# Altium schematic sheet Sheet1.SCHDOC
size 420 x 297 mm; SheetNumber: 1; SheetTotal: 1; Scale: 1:1; DocumentType: Схема электрическая принципиальная; FirstReferrence: АБВГ.123456.001; DocumentName: Sheet1.SCHDOC
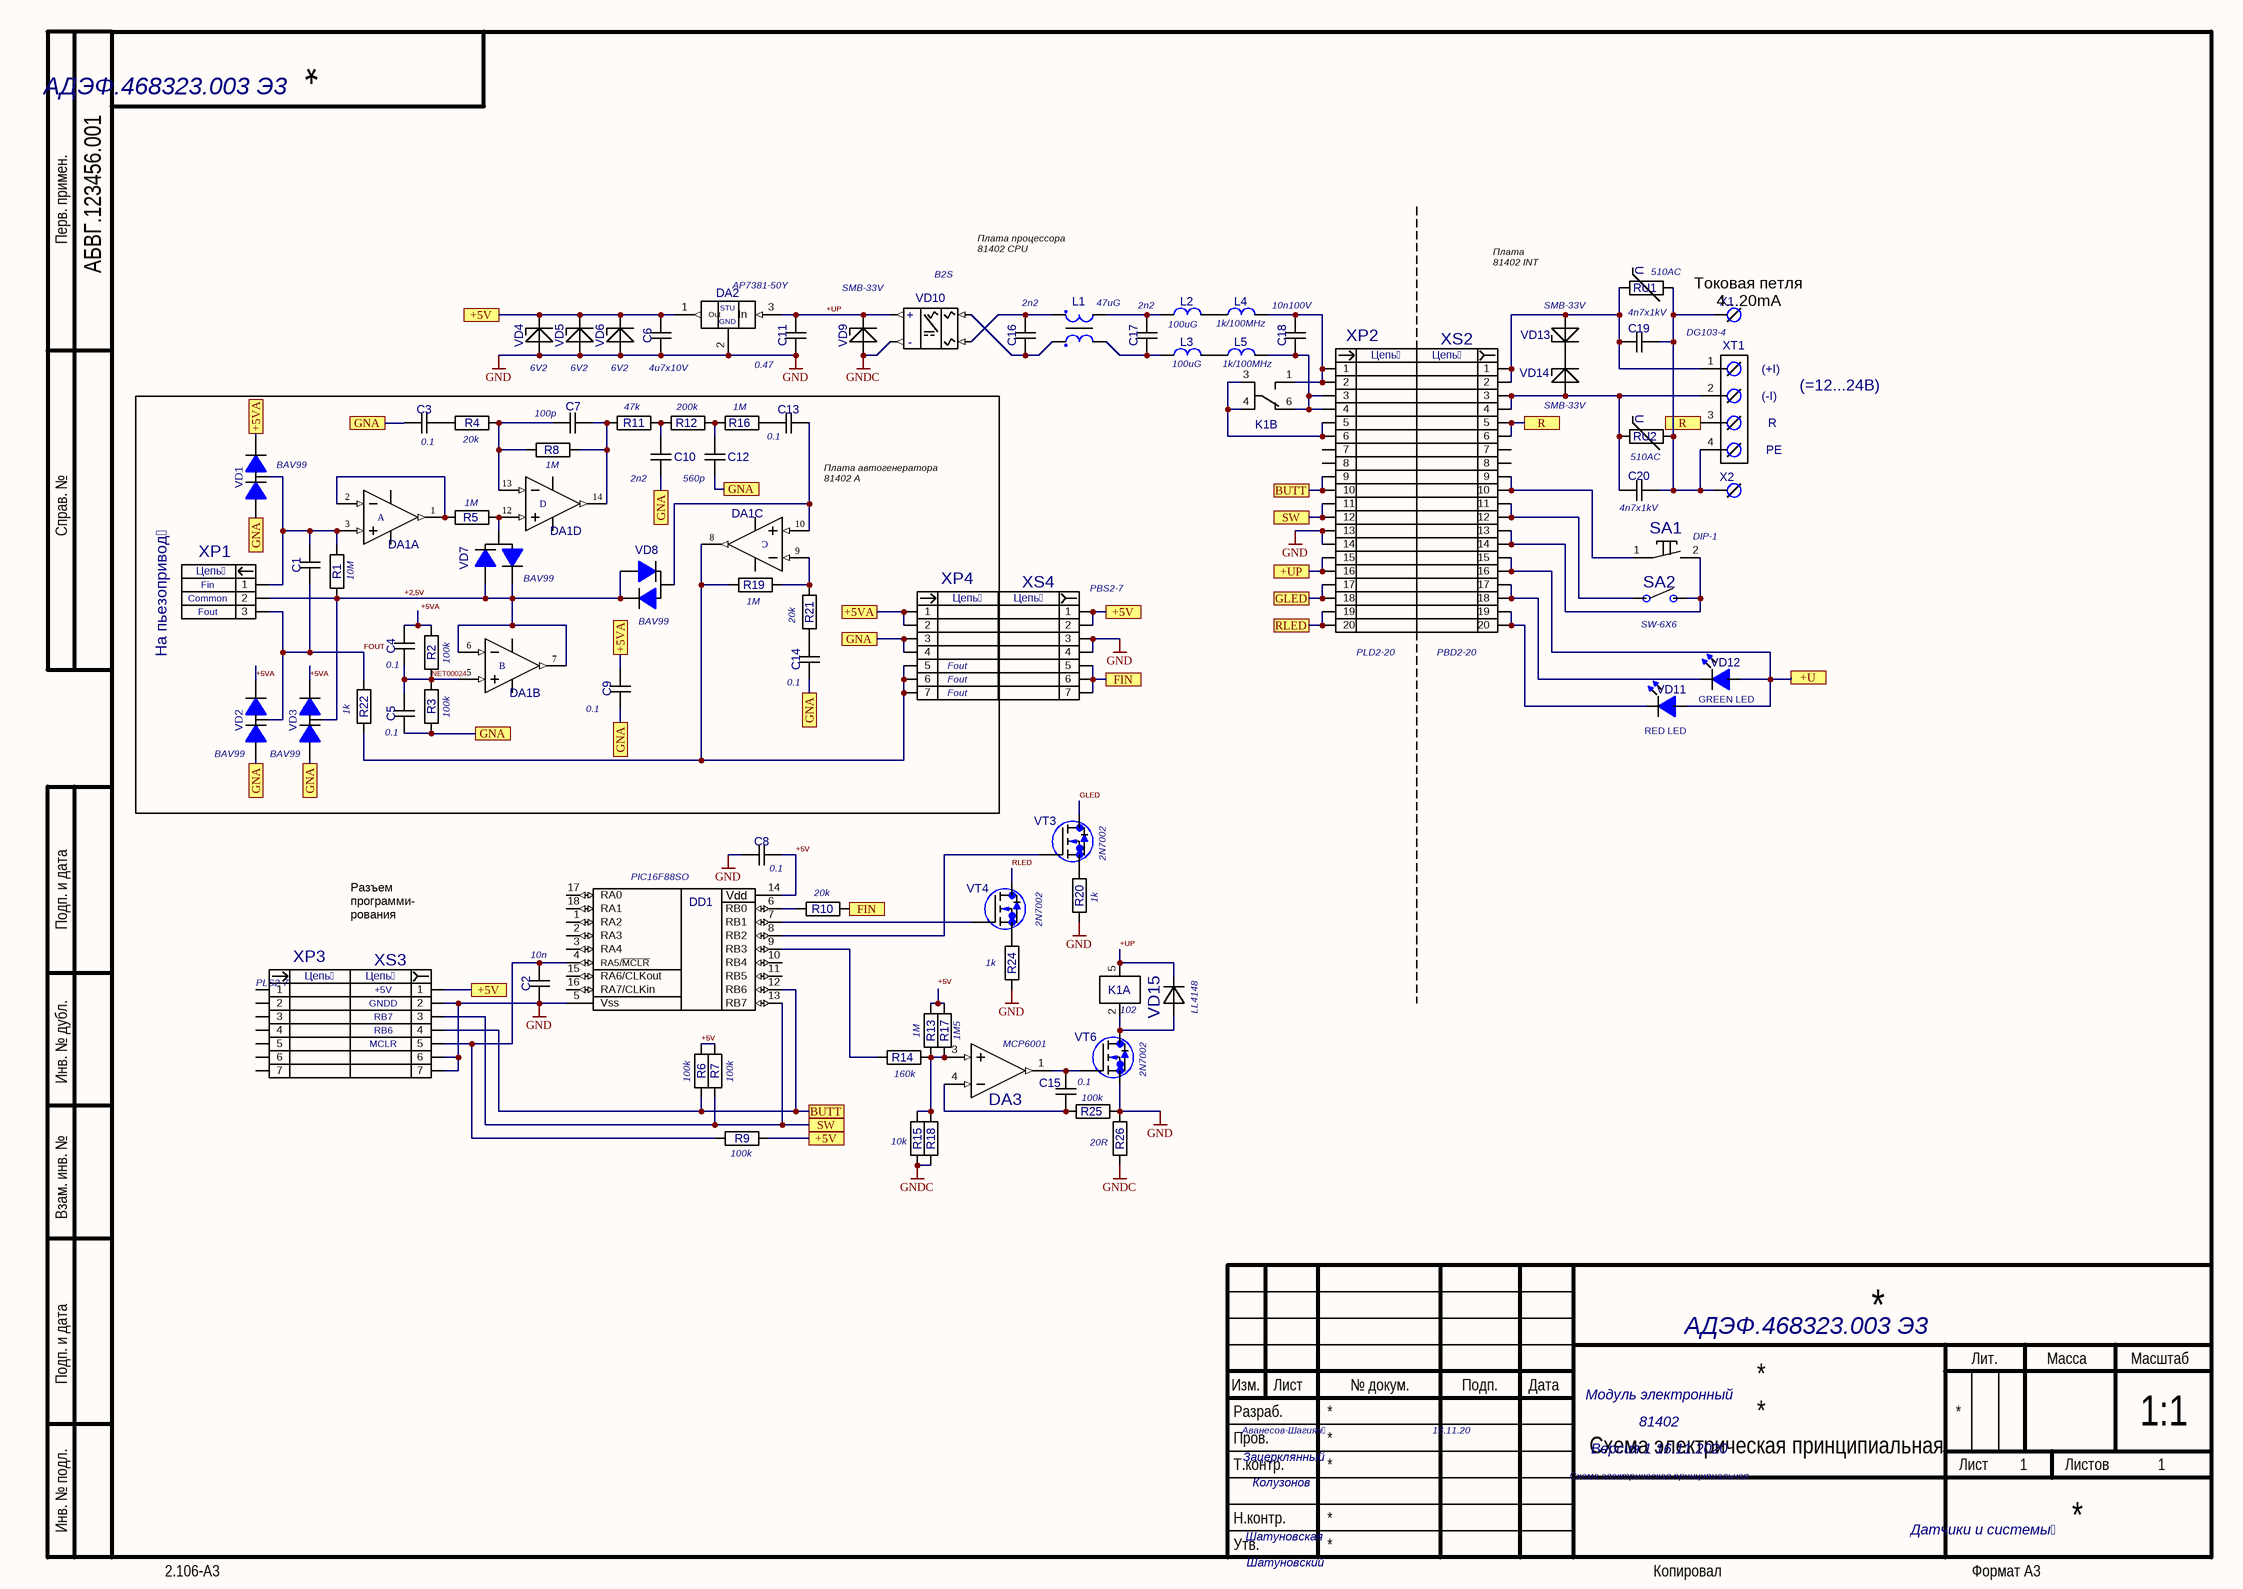
[diagram p0: Sheet1.SCHDOC]

## Parts
C1  CN0805  [0805]  (value not drawn)
C2  CN0805  [0805]  (value not drawn)
C3  CN0805  [0805]  (value not drawn)
C4  CN0805  [0805]  (value not drawn)
C5  CN0805  [0805]  (value not drawn)
C6  CN0805  [0805]  (value not drawn)
C7  CN0805  [0805]  (value not drawn)
C8  CN0805  [0805]  (value not drawn)
C9  CN0805  [0805]  (value not drawn)
C10  CN0805  [0805]  (value not drawn)
C11  CN0805  [0805]  (value not drawn)
C12  CN0805  [0805]  (value not drawn)
C13  CN0805  [0805]  (value not drawn)
C14  CN0805  [0805]  (value not drawn)
C15  CN0805  [0805]  (value not drawn)
C16  CN0805  [0805]  (value not drawn)
C17  CN0805  [0805]  (value not drawn)
C18  CN0805  [0805]  (value not drawn)
C19  CN1210  [1210]  (value not drawn)
C20  CN1210  [1210]  (value not drawn)
DA1  DA-OP-AD8544-SO14  [SO-G14]  (value not drawn)  (parts A,B,C,D of 4)
DA2  DA-STU-78LXXSOT89  [SOT89M]  (value not drawn)
DA3  DA-OP-AD8541-SOT23  [SOT23-(5)]  (value not drawn)
DD1  DD-CPU-PIC16F88SO  [SO18W]  (value not drawn)
K1  value 102  [RELAY102]  (hidden comment: K-RELAY102)  (parts A,B of 2)
L1  L-SF0602  [SF0602]  (value not drawn)
L2  L-1210  [1210]  (value not drawn)
L3  L-1210  [1210]  (value not drawn)
L4  L-0805  [0805]  (value not drawn)
L5  L-0805  [0805]  (value not drawn)
R1  R1206  [1206]  (value not drawn)
R2  R1206  [1206]  (value not drawn)
R3  R1206  [1206]  (value not drawn)
R4  R1206  [1206]  (value not drawn)
R5  R1206  [1206]  (value not drawn)
R6  R1206  [1206]  (value not drawn)
R7  R1206  [1206]  (value not drawn)
R8  R1206  [1206]  (value not drawn)
R9  R1206  [1206]  (value not drawn)
R10  R1206  [1206]  (value not drawn)
R11  R1206  [1206]  (value not drawn)
R12  R1206  [1206]  (value not drawn)
R13  R1206  [1206]  (value not drawn)
R14  R1206  [1206]  (value not drawn)
R15  R1206  [1206]  (value not drawn)
R16  R1206  [1206]  (value not drawn)
R17  R1206  [1206]  (value not drawn)
R18  R1206  [1206]  (value not drawn)
R19  R1206  [1206]  (value not drawn)
R20  R1206  [1206]  (value not drawn)
R21  R1206  [1206]  (value not drawn)
R22  R1206  [1206]  (value not drawn)
R24  R1206  [1206]  (value not drawn)
R25  R1206  [1206]  (value not drawn)
R26  R1206  [1206]  (value not drawn)
RU1  RU-14D  [RU-14D]  (value not drawn)
RU2  RU-14D  [RU-14D]  (value not drawn)
SA1  SA-1DIP  [DIP2]  (value not drawn)
SA2  SA-TACTSW-6X6  [TS_6X6]  (value not drawn)
VD1  VD-DIOD-BAV99V  [SOT23]  (value not drawn)
VD2  VD-DIOD-BAV99V  [SOT23]  (value not drawn)
VD3  VD-DIOD-BAV99V  [SOT23]  (value not drawn)
VD4  VD-BZ-DO213AA  [DO-213AA]  (value not drawn)
VD5  VD-BZ-DO213AA  [DO-213AA]  (value not drawn)
VD6  VD-BZ-DO213AA  [DO-213AA]  (value not drawn)
VD7  VD-DIOD-BAV99  [SOT23]  (value not drawn)
VD8  VD-DIOD-BAV99  [SOT23]  (value not drawn)
VD9  VD-BZ-DO214AA  [DO-214AA]  (value not drawn)
VD10  VD-B2S  [DIP_4_SMD_BXS]  (value not drawn)
VD11  VD-LED-3MM  [LED300]  (value not drawn)
VD12  VD-LED-3MM  [LED300]  (value not drawn)
VD13  VD-BZ-DO214AA  [DO-214AA]  (value not drawn)
VD14  VD-BZ-DO214AA  [DO-214AA]  (value not drawn)
VD15  VD-DIOD-SOD80  [SOD-80]  (value not drawn)
VT3  VT-MOSFET_N-SOT23  [SOT23]  (value not drawn)
VT4  VT-MOSFET_N-SOT23  [SOT23]  (value not drawn)
VT6  VT-MOSFET_N-SOT23  [SOT23]  (value not drawn)
X1  X-BUSH_CONT_450  [BUSH_CONT_450]  (value not drawn)
X2  X-BUSH_CONT_450  [BUSH_CONT_450]  (value not drawn)
XP1  XP-3-PLS-R  [PLS-3R]  (value not drawn)
XP2  XP-20-PLD2  [PLD2-20]  (value not drawn)
XP3  value PLS2-7  [PLS2-7]  (hidden comment: XP-7-PLS-7)
XP4  XP-7-PLS-7  [PLS2-7]  (value not drawn)
XS2  XS-20-PBD2  [PBD2-20]  (value not drawn)
XS3  XS-7-PBS2  [PBS2-7]  (value not drawn)
XS4  value PBS2-7  [PBS2-7]  (hidden comment: XS-7-PBS2)
XT1  XT-4-330  [XT-4-330]  (value not drawn)

## Blocks framed on the sheet
На пьезопривод: C1 C3-C5 C7 C9 C10 C12-C14 DA1 R1-R5 R8 R11 R12 R16 R19 R21 R22 VD1-VD3 VD7 VD8 XP1 XP4

## Ports
+5V, +5VA, +U, +UP, BUTT, FIN, GLED, GNA, R, RLED, SW

## Nets
+5V: C8.1 DA3.5(V+) DD1.14(Vdd) R6.2 R7.2
+5VA: DA1.4(V+) VD2.2(K) VD3.2(K)
GNA: DA1.11(V-)
GND: C2.2 C6.2 C8.2 C11.2 DA2.2(GND) DA2.4(GND) DA3.2(V-) DD1.5(Vss) R20.2 R24.2 R25.1 R26.1 VD4.1(A) VD5.1(A) VD6.1(A) VT6.2(Source) XP2.13 XP2.14 XS3.2 XS3.6 XS3.7 XS4.3 XS4.4
GNDC: R15.2 R18.2 R26.2 VD9.1(A) VD10.4(-V)
+2,5V: DA1.6(IN-) DA1.7(OUT) R1.1 VD3.3(K/A) VD7.1(A) VD7.2(K) VD8.1(A) VD8.2(K) XP1.2
+5V: C6.1 DA2.1(Out) R9.1 VD4.2(K) VD5.2(K) VD6.2(K) XS3.1 XS4.1 XS4.2 ; port +5V  [a separate net that carries the same name]
+5VA: C9.1 VD1.2(K) XP4.1 XP4.2 ; port +5VA  [a separate net that carries the same name]
+U: VD11.1(A) VD12.1(A) XS2.15 XS2.16 ; port +U
+UP: C11.1 DA2.3(In) K1.5 VD9.2(K) VD10.3(+V) VD15.2(K)
+UP: XP2.15 XP2.16 ; port +UP  [a separate net that carries the same name]
BUTT: DD1.12(RB6) R6.1 XP2.9 XP2.10 XS3.4 ; port BUTT
FIN: R10.2 XS4.5 XS4.6 XS4.7 ; port FIN
FOUT: C1.2 R22.1 VD2.3(K/A) XP1.3
GLED: VT3.3(drain)
GLED: XP2.17 XP2.18 ; port GLED  [a separate net that carries the same name]
GNA: C3.2 C5.2 C9.2 C10.2 C12.2 C14.2 R3.1 VD1.1(A) VD2.1(A) VD3.1(A) XP4.3 XP4.4 ; port GNA  [a separate net that carries the same name]
NET00024: C4.2 C5.1 DA1.5(IN+) R2.1 R3.2
R: XS2.5 XS2.6 XT1.3(Contact3) ; port R
RLED: XP2.19 XP2.20 ; port RLED
RLED: VT4.3(drain)  [a separate net that carries the same name]
SW: DD1.13(RB7) R7.1 XP2.11 XP2.12 XS3.3 ; port SW
NetC1_1: C1.1 DA1.3(IN+) R1.2 VD1.3(K/A) XP1.1
NetC2_1: C2.1 DD1.4(RA5/~{MCLR}) R9.2 XS3.5
NetC3_1: C3.1 R4.2
NetC4_1: C4.1 R2.2
NetC7_1: C7.1 DA1.14(OUT) R8.1 R11.2
NetC7_2: C7.2 DA1.13(IN-) R4.1 R8.2
NetC10_1: C10.1 R11.1 R12.2
NetC12_1: C12.1 R12.1 R16.2
NetC13_1: C13.1 DA1.10(IN+) VD8.3(K/A)
NetC13_2: C13.2 R16.1
NetC14_1: C14.1 R21.2
NetC15_1: C15.1 DA3.1(out) VT6.1(Gait)
NetC15_2: C15.2 DA3.4(-in) R25.2
NetC16_1: C16.1 L1.1 VD10.1
NetC16_2: C16.2 L1.2 VD10.2
NetC17_1: C17.1 L1.4 L2.1
NetC17_2: C17.2 L1.3 L3.1
NetC18_1: C18.1 K1.1 L4.2 XP2.1 XP2.2
NetC18_2: C18.2 K1.6 L5.2 XP2.3 XP2.4
NetC19_1: C19.1 C20.1 RU1.1 RU2.1 X1.1 X2.1 XT1.4(Contact4)
NetC19_2: C19.2 RU1.2 VD13.1(A) XS2.1 XS2.2 XT1.1(Contact1)
NetC20_2: C20.2 RU2.2 VD14.1(A) XS2.3 XS2.4 XT1.2(Contact2)
NetDA1_1: DA1.1(OUT) DA1.2(IN-) R5.2
NetDA1_8: DA1.8(OUT) R19.2 R22.2 XP4.5 XP4.6 XP4.7
NetDA1_9: DA1.9(IN-) R19.1 R21.1
NetDA1_12: DA1.12(IN+) R5.1 VD7.3(K/A)
NetDA3_3: DA3.3(+in) R13.2 R14.1 R15.1 R17.2 R18.1
NetDD1_6: DD1.6(RB0) R10.1
NetDD1_7: DD1.7(RB1) VT4.1(Gait)
NetDD1_8: DD1.8(RB2) VT3.1(Gait)
NetDD1_9: DD1.9(RB3) R14.2
NetK1_2: K1.2 VD15.1(A) VT6.3(drain)
NetK1_3: K1.3 K1.4 XP2.5 XP2.6
NetL2_2: L2.2 L4.1
NetL3_2: L3.2 L5.1
NetR13_1: R13.1 R17.1
NetR20_1: R20.1 VT3.2(Source)
NetR24_1: R24.1 VT4.2(Source)
NetSA1_1: SA1.1 XS2.9 XS2.10
NetSA1_2: SA1.2 SA2.1 XS2.13 XS2.14
NetSA2_2: SA2.2 XS2.11 XS2.12
NetVD11_2: VD11.2(K) XS2.19 XS2.20
NetVD12_2: VD12.2(K) XS2.17 XS2.18
NetVD13_2: VD13.2(K) VD14.2(K)

Not connected (* = marked no-connect by the designer): DD1 1(RA2) 2(RA3) 3(RA4) 10(RB4) 11(RB5) 15(RA6/CLKout) 16(RA7/CLKin) 17(RA0) 18(RA1); SA2 3 4; XP2 7 8; XP3 1 2 3 4 5 6 7; XS2 7 8

## Notes on the sheet
- АДЭФ.468323.003 Э3
- Плата процессора
  81402 CPU
- AP7381-50Y
- SMB-33V
- (near VD10) B2S
- 2n2
- (near L1) 47uG
- (near L2) 100uG
- (near L4) 1k/100MHz
- 10n100V
- Плата
  81402 INT
- (near VD13) SMB-33V
- 4n7x1kV
- (near RU1) 510AC
- (near X1) DG103-4
- (near VD4) 6V2
- (near VD5) 6V2
- (near VD6) 6V2
- (near C6) 4u7x10V
- 0.47
- (near L3) 100uG
- (near L5) 1k/100MHz
- (near XT1) (-I)
- (near XT1) (+I)
- (=12...24В)
- (near VD1) BAV99
- 0.1
- (near R4) 20k
- (near C7) 100p
- (near R8) 1M
- (near R11) 47k
- (near R12) 200k
- (near R16) 1M
- (near VD14) SMB-33V
- (near RU2) 510AC
- Токовая петля
  4...20mA
- (near XT1) R
- PE
- (near R5) 1M
- (near C10) 2n2
- (near C12) 560p
- Плата автогенератора
  81402 А
- (near C20) 4n7x1kV
- (near SA1) DIP-1
- (near XP1) Fin
- (near XP1) Common
- (near R1) 10M
- (near VD7) BAV99
- (near R19) 1M
- (near XP1) Fout
- (near C4) 0.1
- (near R2) 100k
- (near VD8) BAV99
- (near R21) 20k
- (near XP4) Fout
- (near XP2) PLD2-20
- (near XS2) PBD2-20
- (near SA2) SW-6X6
- (near R22) 1k
- (near C5) 0.1
- (near R3) 100k
- (near C9) 0.1
- (near C14) 0.1
- (near VD11) RED LED
- (near VD12) GREEN LED
- (near VD2) BAV99
- BAV99
- (near C8) 0.1
- 2N7002
- (near XS3) Разъем
  программи-
  рования
- (near DD1) PIC16F88SO
- (near R10) 20k
- (near R20) 1k
- (near XS3) +5V
- (near XS3) GNDD
- (near C2) 10n
- (near R24) 1k
- (near VD15) LL4148
- (near XS3) RB6
- (near XS3) RB7
- (near XS3) MCLR
- (near R6) 100k
- (near R7) 100k
- (near R14) 160k
- (near R13) 1M
- (near R17) 1M5
- (near DA3) MCP6001
- (near VT6) 2N7002
- (near R15) 10k
- (near R25) 100k
- (near R26) 20R
- (near R9) 100k
- Модуль электронный
- Колузонов
- Зацерклянный
- Аванесов-Шагиян
- 16.11.20
- 81402
- Схема электрическая принципиальная
- Версия 1 16.11.2020
- Шатуновская
- Датчики и системы
- Шатуновский
- Перв. примен.
- Справ. №
- Подп. и дата
- Инв. № дубл.
- Взам. инв. №
- Разраб.
- Изм.
- Лист
- № докум.
- Подп.
- Дата
- Лит.
- Масса
- Масштаб
- Пров.
- Т.контр.
- Листов
- Инв. № подл.
- Утв.
- Н.контр.
- 2.106-A3
- Копировал
- Формат А3
- (in symbol DA-OP-AD8544-SO14, part A) A
- (in symbol DA-OP-AD8544-SO14, part B) B
- (in symbol DA-OP-AD8544-SO14, part C) C
- (in symbol DA-OP-AD8544-SO14, part D) D
- (in symbol DA-STU-78LXXSOT89) STU
- (in symbol RU-14D) U
- (in symbol VD-B2S) +; -
- (in symbol XP-3-PLS-R) Цепь
- (in symbol XP-7-PLS-7) Цепь
- (in symbol XP-20-PLD2) Цепь
- (in symbol XS-7-PBS2) Цепь
- (in symbol XS-20-PBD2) Цепь

## Library data of the parts
C2 = CN0805: Value: 10n
C3-C5 C8 C9 C13-C15 = CN0805: Value: 0.1
C6 = CN0805: Value: 4u7x10V
C7 = CN0805: Value: 100p
C10 C16 C17 = CN0805: Value: 2n2
C11 = CN0805: Value: 0.47
C12 = CN0805: Value: 560p
C18 = CN0805: Value: 10n100V
C19 C20 = CN1210: Value: 4n7x1kV
DA1 = DA-OP-AD8544-SO14: Micropower Single-Supply Rail-to-Rail Input/Output Operational Amplifier; Value: LMV324D; OriginalName: OP491GS; ComponentField6: Published 8-Jun-2000
DA2 = DA-STU-78LXXSOT89: Value: AP7381-50Y
DA3 = DA-OP-AD8541-SOT23: Value: MCP6001; OriginalName: AD8531AR; ComponentField7: Published 8-Jun-2000, Modified 10-July-2000: SIM Model Added.; ComponentField6: Pin 8 is not connected. Parameters RG and RB are not available in SPICE. As a result simulation generates an error, however output correct.
L1 = L-SF0602: Value: 47uG
L2 L3 = L-1210: Value: 100uG
L4 L5 = L-0805: Value: 1k/100MHz
R1 = R1206: Value: 10M
R2 R3 R6 R7 R9 R25 = R1206: Value: 100k
R4 R10 R21 = R1206: Value: 20k
R5 R8 R13 R16 R19 = R1206: Value: 1M
R11 = R1206: Value: 47k
R12 = R1206: Value: 200k
R14 = R1206: Value: 160k
R15 = R1206: Value: 10k
R17 = R1206: Value: 1M5
R20 R22 R24 = R1206: Value: 1k
R26 = R1206: Value: 20R
RU1 RU2 = RU-14D: Value: 510AC
SA1 = SA-1DIP: Value: DIP-1
SA2 = SA-TACTSW-6X6: Value: SW-6X6
VD1 = VD-DIOD-BAV99V: Value: BAV99V
VD2 VD3 = VD-DIOD-BAV99V: Value: BAV99
VD4-VD6 = VD-BZ-DO213AA: Value: 6V2
VD7 VD8 = VD-DIOD-BAV99: Value: BAV99
VD9 = VD-BZ-DO214AA: Value: 33V
VD10 = VD-B2S: Value: B2S
VD11 = VD-LED-3MM: Value: LED-3MM-Red
VD12 = VD-LED-3MM: Value: LED-3MM-Green
VD13 VD14 = VD-BZ-DO214AA: Value: SMB-33V
VD15 = VD-DIOD-SOD80: Value: LL4148
VT3 VT4 VT6 = VT-MOSFET_N-SOT23: Value: 2N7002
XP1 = XP-3-PLS-R: Value: PLS3-R
XP2 = XP-20-PLD2: Value: PLD2-20
XS2 = XS-20-PBD2: Value: PBD2-20
XT1 = XT-4-330: Value: DG103-4
DD1 = DD-CPU-PIC16F88SO: Value: PIC16F88SO
X1 X2 = X-BUSH_CONT_450: Value: *
XS3 XS4 = XS-7-PBS2
  XS3: Value: *